# Altium schematic sheet wifi.SchDoc
size A2
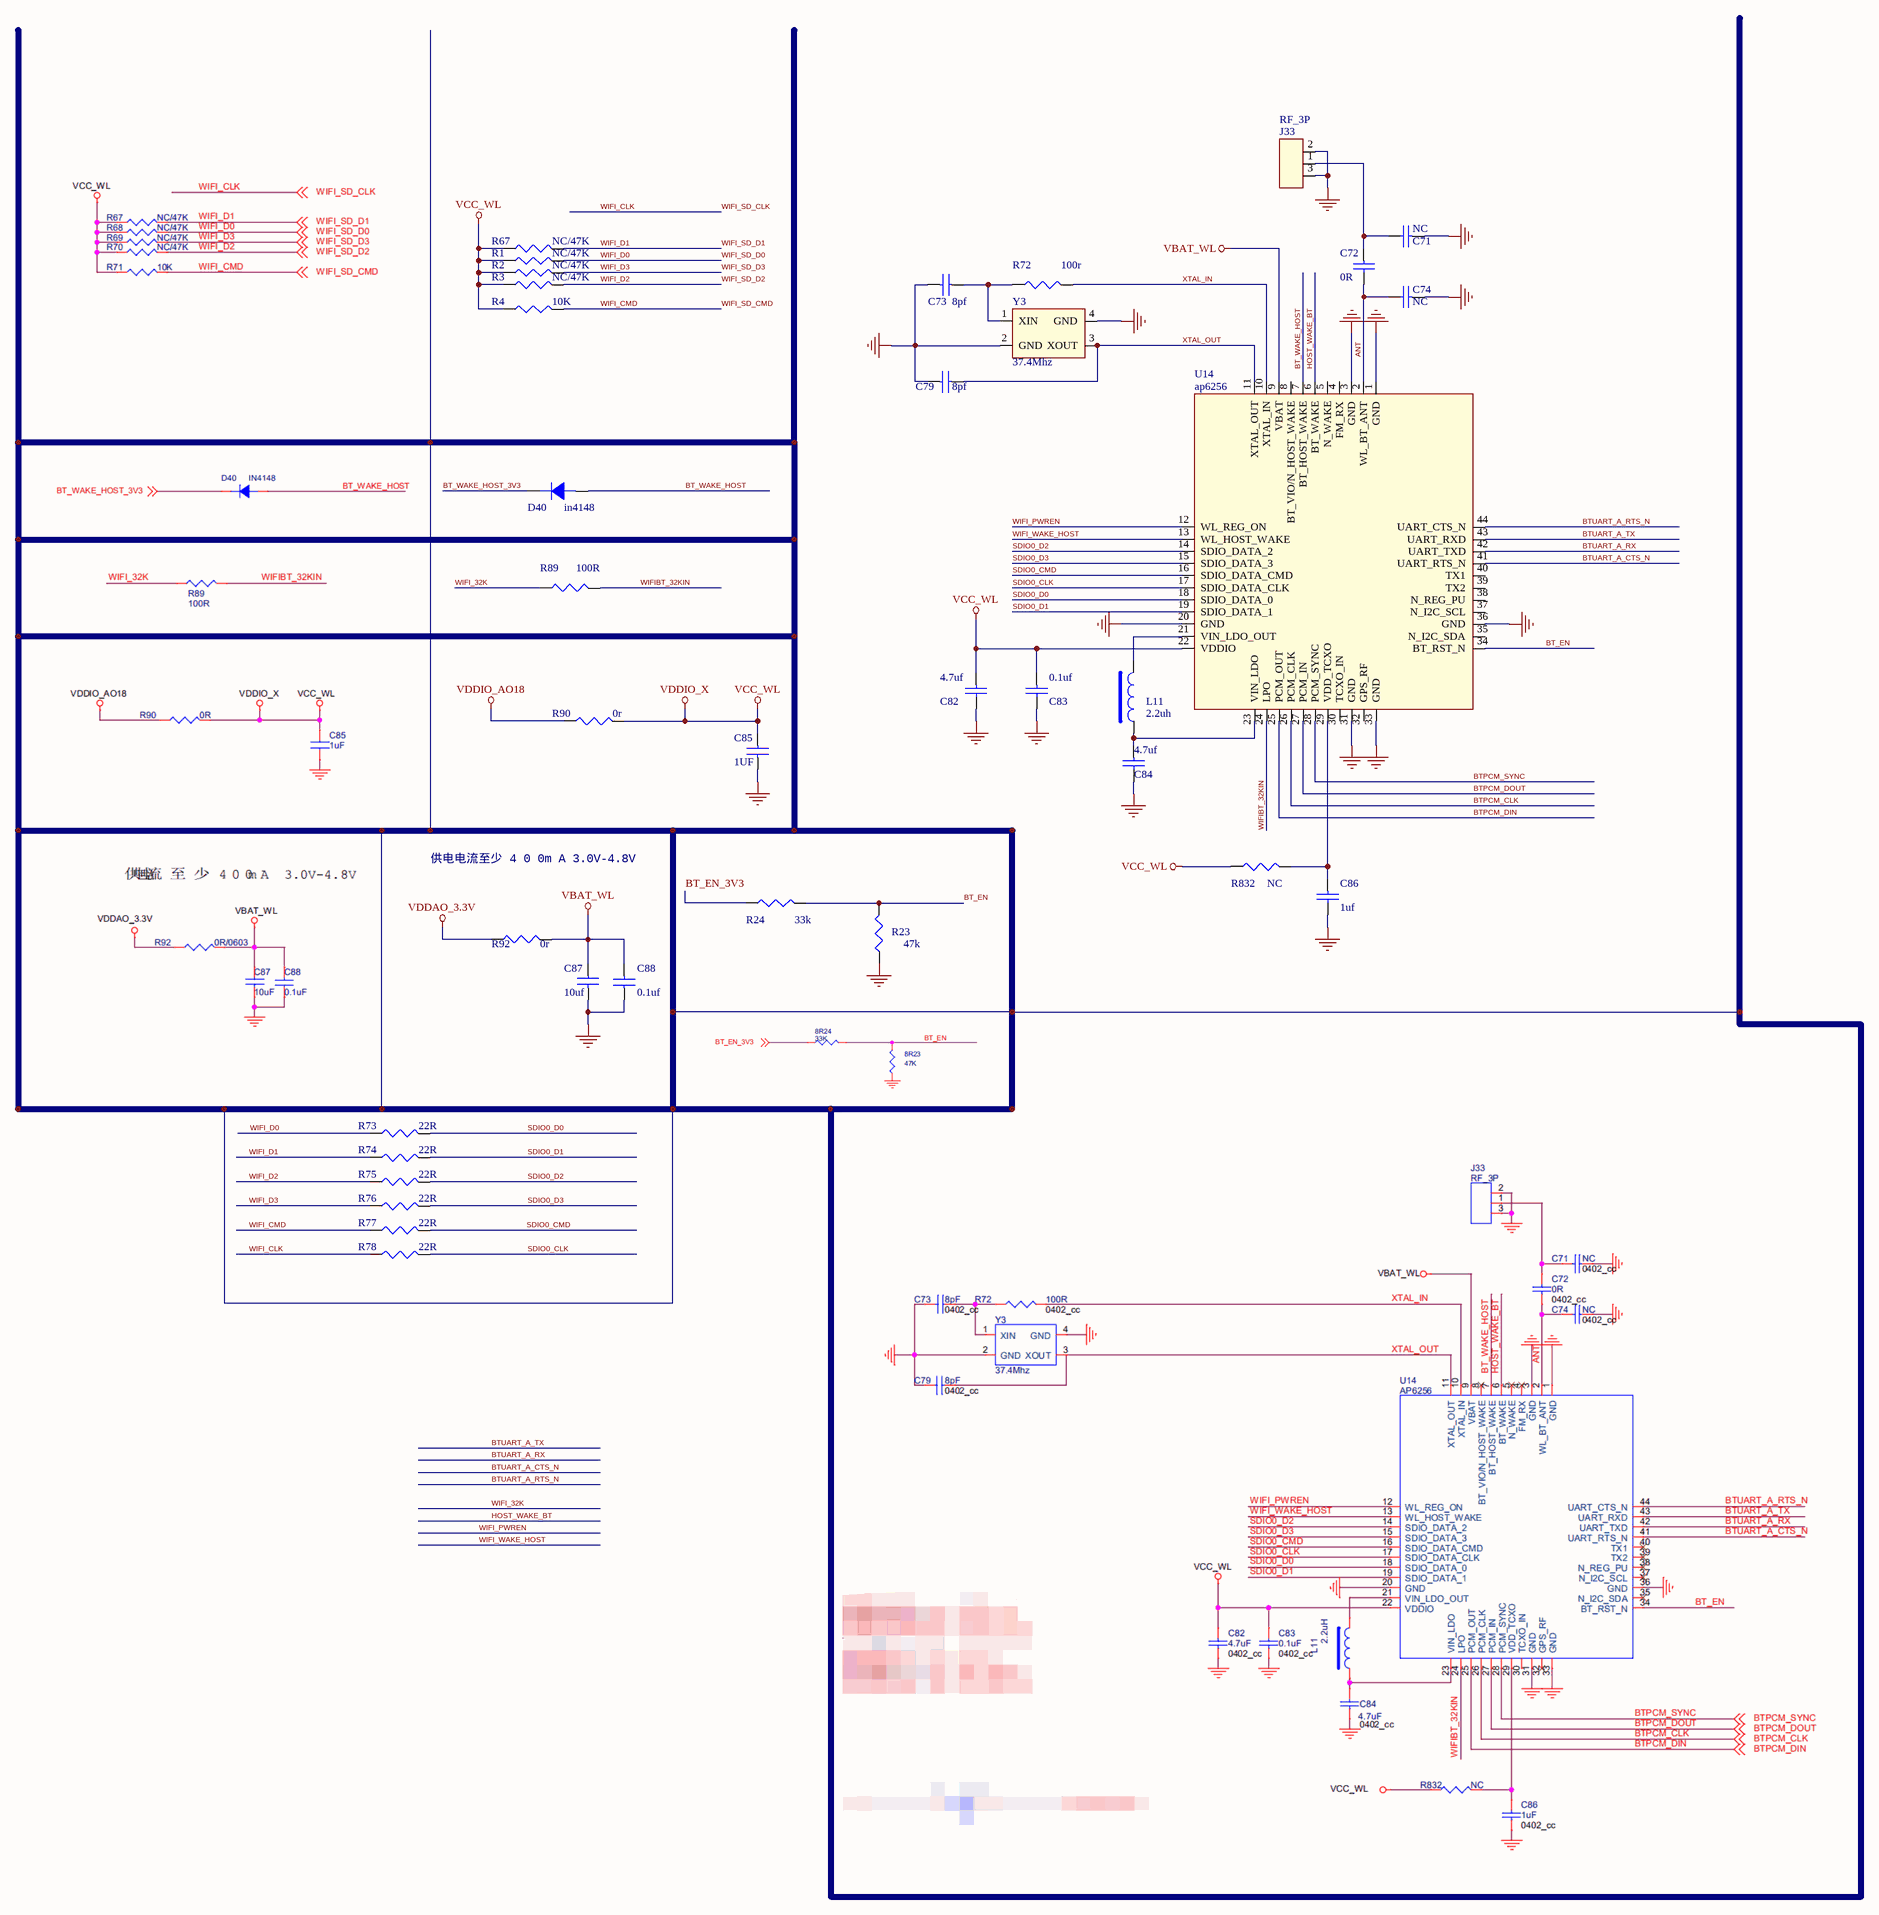
[diagram p0: wifi.SchDoc]

## Parts
C71  NC
C72  0R
C73  8pf  [C0402]
C74  NC
C79  8pf  [C0402]
C82  4.7uf
C83  0.1uf
C84  4.7uf
C85  1UF  [C0402]
C86  1uf
C87  10uf  [C0402]
C88  0.1uf  [C0402]
D40  in4148
J33  RF_3P
L11  2.2uh
R1  NC/47K
R2  NC/47K
R3  NC/47K
R4  10K
R23  47k
R24  33k
R67  NC/47K
R72  100r  [R0402]
R73  22R
R74  22R
R75  22R
R76  22R
R77  22R
R78  22R
R89  100R
R90  0r
R92  0r
R832  NC
U14  ap6256
Y3  37.4Mhz  [CRY-3225]

## Nets
NetC71_2: C71.2 C73.2 C74.2 C79.1 C82.1 C83.1 C84.1 C85.2 C86.1 C87.2 C88.1 J33.2 J33.3 R23.1 U14.1(GND) U14.3(GND) U14.20(GND) U14.31(GND) U14.33(GND) U14.36(GND) Y3.2(GND) Y3.4(GND)
VBAT_WL: C87.1 C88.2 R92.1 U14.9(VBAT)
VCC_WL: C82.2 C83.2 C85.1 R1.1 R2.1 R3.1 R4.1 R67.1 R90.1 R832.1 U14.22(VDDIO)  [also labelled VDDIO_X]
VDDAO_3.3V: R92.2
VDDIO_AO18: R90.2
ANT: C72.1 C74.1 U14.2(WL_BT_ANT)
BT_EN: R23.2 R24.2 U14.34(BT_RST_N)
BT_EN_3V3: R24.1
BT_WAKE_HOST: D40.1(A) U14.7(BT_HOST_WAKE)
BT_WAKE_HOST_3V3: D40.2(K)
BTPCM_CLK: U14.26(PCM_CLK)
BTPCM_DIN: U14.25(PCM_OUT)
BTPCM_DOUT: U14.27(PCM_IN)
BTPCM_SYNC: U14.28(PCM_SYNC)
BTUART_A_CTS_N: U14.41(UART_RTS_N)
BTUART_A_RTS_N: U14.44(UART_CTS_N)
BTUART_A_RX: U14.42(UART_TXD)
BTUART_A_TX: U14.43(UART_RXD)
HOST_WAKE_BT: U14.6(BT_WAKE)
SDIO0_CLK: R78.2 U14.17(SDIO_DATA_CLK)
SDIO0_CMD: R77.2 U14.16(SDIO_DATA_CMD)
SDIO0_D0: R73.2 U14.18(SDIO_DATA_0)
SDIO0_D1: R74.2 U14.19(SDIO_DATA_1)
SDIO0_D2: R75.2 U14.14(SDIO_DATA_2)
SDIO0_D3: R76.2 U14.15(SDIO_DATA_3)
WIFI_32K: R89.2
WIFI_CLK: R78.1  [also labelled WIFI_SD_CLK]
WIFI_CMD: R4.2 R77.1  [also labelled WIFI_SD_CMD]
WIFI_D0: R1.2 R73.1  [also labelled WIFI_SD_D0]
WIFI_D1: R67.2 R74.1  [also labelled WIFI_SD_D1]
WIFI_D2: R3.2 R75.1  [also labelled WIFI_SD_D2]
WIFI_D3: R2.2 R76.1  [also labelled WIFI_SD_D3]
WIFI_PWREN: U14.12(WL_REG_ON)
WIFI_WAKE_HOST: U14.13(WL_HOST_WAKE)
WIFIBT_32KIN: R89.1 U14.24(LPO)
XTAL_IN: R72.2 U14.10(XTAL_IN)
XTAL_OUT: C79.2 U14.11(XTAL_OUT) Y3.3(XOUT)
NetC71_1: C71.1 C72.2 J33.1
NetC73_1: C73.1 R72.1 Y3.1(XIN)
NetC84_2: C84.2 L11.1 U14.23(VIN_LDO)
NetC86_2: C86.2 R832.2 U14.29(VDD_TCXO)
NetL11_2: L11.2 U14.21(VIN_LDO_OUT)

Not connected (* = marked no-connect by the designer): U14 4(FM_RX) 5(N_WAKE) 8(BT_VIO/N_HOST_WAKE) 30(TCXO_IN) 32(GPS_RF) 35(N_I2C_SDA) 37(N_I2C_SCL) 38(N_REG_PU) 39(TX2) 40(TX1)

## Notes on the sheet
- 供电电流至少 4 0 0m A 3.0V-4.8V

## Library data of the parts
C71 C72 C74 C82-C84 C86 = CAPNP_Dup1_1
C73 C79 C85 C87 C88 = CAP NP
D40 = DIODE: J102: U4
J33 = CON3_1
L11 = INDUCTOR_1
R1-R4 R23 R24 R67 R73-R78 R89 R832 = RESISTOR
R72 = R_0
R90 R92 = RESISTOR_1
U14 = AP6493_1
Y3 = CRYSTAL-4_4: ass